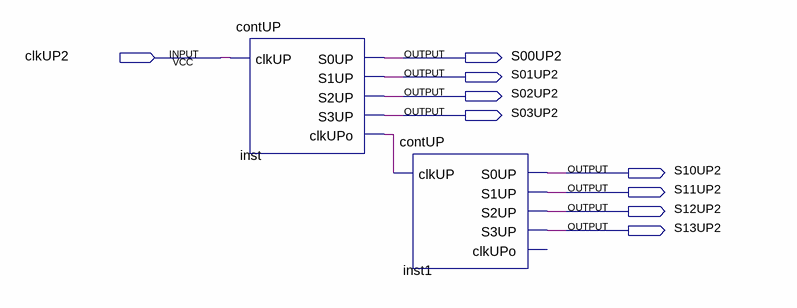
[diagram p0: schematic sheet]
// Quartus schematic contUP2.bdf as structural Verilog: 2 symbols, 9 pins
module contUP2 (
  input  clkUP2,
  output S00UP2,
  output S01UP2,
  output S02UP2,
  output S03UP2,
  output S10UP2,
  output S11UP2,
  output S12UP2,
  output S13UP2
);

  wire inst_clkupo;

  contUP inst (.clkUP(clkUP2), .S0UP(S00UP2), .S1UP(S01UP2), .S2UP(S02UP2), .S3UP(S03UP2), .clkUPo(inst_clkupo));
  contUP inst1 (.clkUP(inst_clkupo), .S0UP(S10UP2), .S1UP(S11UP2), .S2UP(S12UP2), .S3UP(S13UP2));  // open: clkUPo
endmodule
